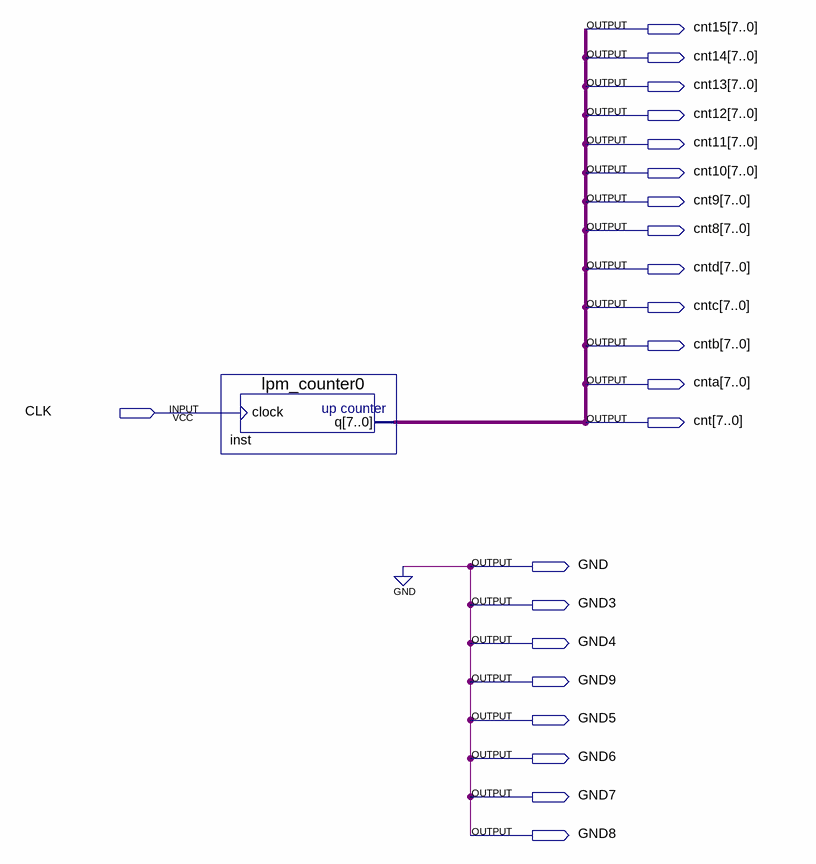
[diagram p0: schematic sheet]
// Quartus schematic fpgatest.bdf as structural Verilog: 1 symbols, 22 pins
module fpgatest (
  input  CLK,
  output [7:0] cnt15,
  output [7:0] cnt14,
  output [7:0] cnt13,
  output [7:0] cnt12,
  output [7:0] cnt11,
  output [7:0] cnt10,
  output [7:0] cnt9,
  output [7:0] cnt8,
  output [7:0] cntd,
  output [7:0] cntc,
  output [7:0] cntb,
  output [7:0] cnta,
  output [7:0] cnt,
  output GND,
  output GND3,
  output GND4,
  output GND9,
  output GND5,
  output GND6,
  output GND7,
  output GND8
);

  lpm_counter0 inst (.clock(CLK), .q(cnt));

  assign cnt8 = cnt;
  assign cnt9 = cnt;
  assign cnt10 = cnt;
  assign cnt11 = cnt;
  assign cnt12 = cnt;
  assign cnt13 = cnt;
  assign cnt14 = cnt;
  assign cnt15 = cnt;
  assign cnta = cnt;
  assign cntb = cnt;
  assign cntc = cnt;
  assign cntd = cnt;
  assign GND = 1'b0;
  assign GND3 = 1'b0;
  assign GND4 = 1'b0;
  assign GND5 = 1'b0;
  assign GND6 = 1'b0;
  assign GND7 = 1'b0;
  assign GND8 = 1'b0;
  assign GND9 = 1'b0;
endmodule
